# Altium schematic sheet mishen.SchDoc
size A4
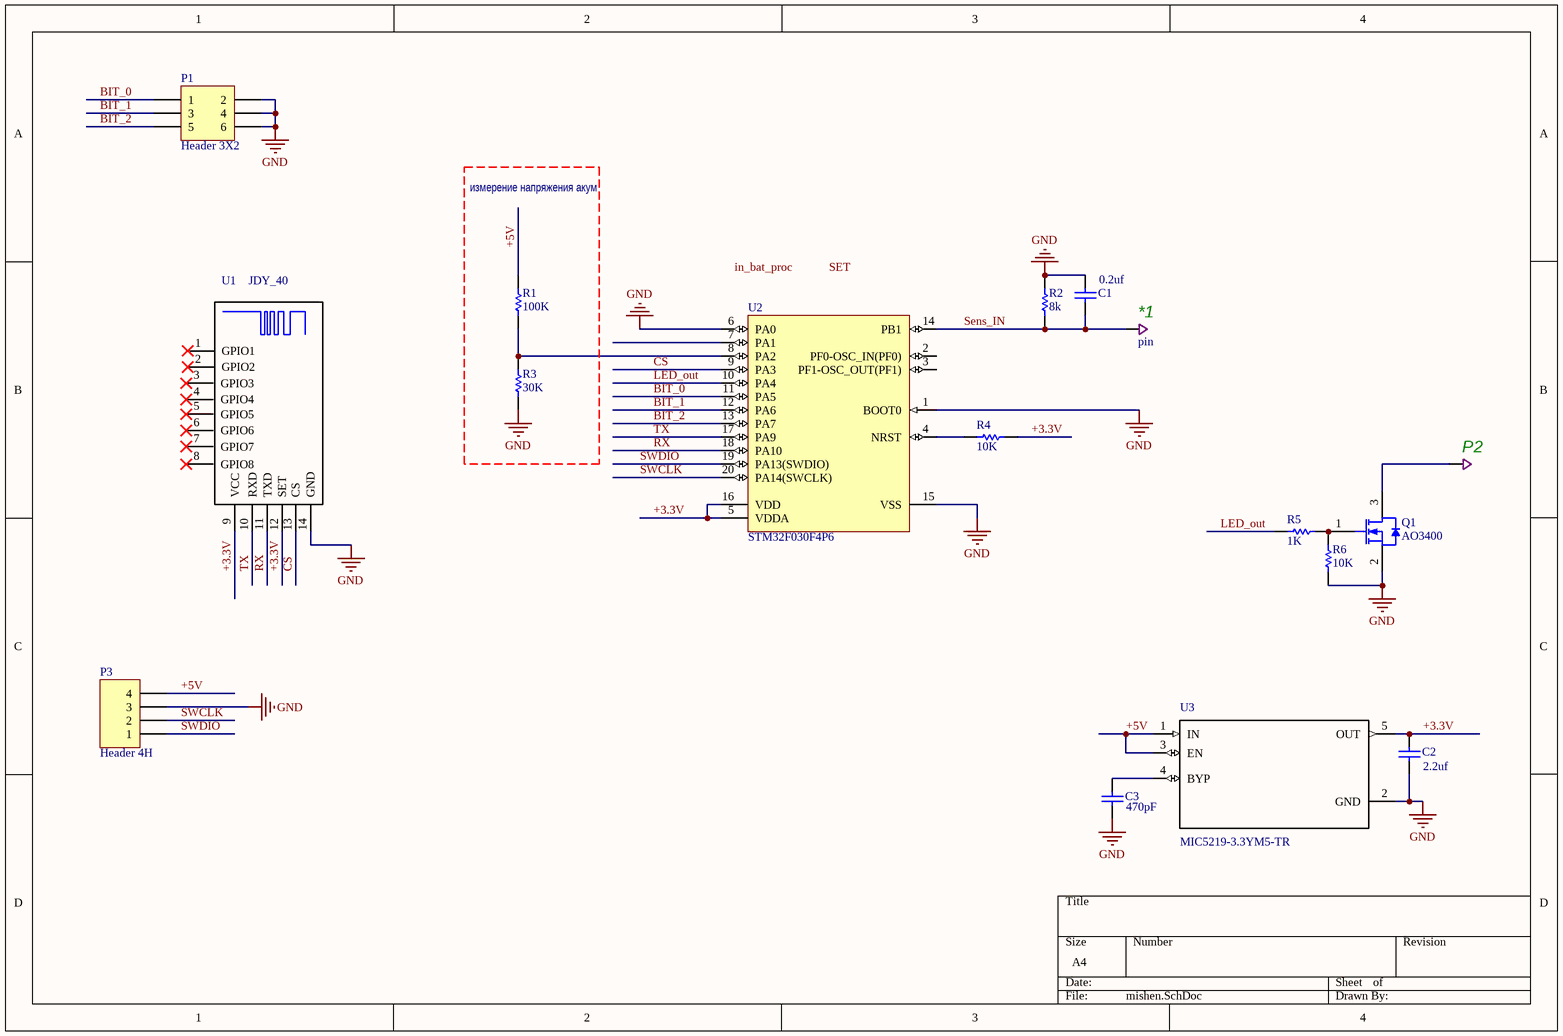
[diagram p0: mishen.SchDoc]

## Parts
*1  pin  [pin]
C1  0.2uf  [CAPC0603(1608)100_L]
C2  2.2uf  [CAPC0603(1608)100_L]
C3  470pF  [CAPC0603(1608)100_L]
P1  Header 3X2  [HDR2X3]
P2  pin  [pin]  (value not drawn)
P3  Header 4H  [HDR1X4H]
Q1  AO3400  [AO-SOT23-3_V]
R1  100K  [RESC2013X70X40ML20T20]
R2  8k  [RESC2013X70X40ML20T20]
R3  30K  [RESC2013X70X40ML20T20]
R4  10K  [RESC2013X70X40ML20T20]
R5  1K  [RESC2013X70X40ML20T20]
R6  10K  [RESC2013X70X40ML20T20]
U1  JDY_40  [JDY_40]
U2  STM32F030F4P6  [STM-TSSOP20_N]
U3  MIC5219-3.3YM5-TR  [mic51]

## Nets
GND: C1.2 C2.1 C3.1 P1.2 P1.4 P1.6 P3.3 Q1.2(S) R2.1 R3.2 R6.2 U1.14(GND) U2.1(BOOT0) U2.6(PA0) U2.15(VSS) U3.2(GND)
+3.3V: C2.2 R4.1 U1.9(VCC) U1.12(SET) U2.5(VDDA) U2.16(VDD) U3.5(OUT)
+5V: P3.4 R1.1 U3.1(IN) U3.3(EN)
BIT_0: P1.1 U2.11(PA5)
BIT_1: P1.3 U2.12(PA6)
BIT_2: P1.5 U2.13(PA7)
CS: U1.13(CS) U2.9(PA3)
LED_out: R5.2 U2.10(PA4)
RX: U1.11(TXD) U2.18(PA10)
Sens_IN: *1.0 C1.1 R2.2 U2.14(PB1)
SWCLK: P3.2 U2.20(PA14(SWCLK))
SWDIO: P3.1 U2.19(PA13(SWDIO))
TX: U1.10(RXD) U2.17(PA9)
NetC3_2: C3.2 U3.4(BYP)
NetP2_0: P2.0 Q1.3(D)
NetQ1_1: Q1.1(G) R5.1 R6.1
NetR1_2: R1.2 R3.1 U2.8(PA2)
NetR4_2: R4.2 U2.4(NRST)

Not connected (* = marked no-connect by the designer): U1 1(GPIO1)* 2(GPIO2)* 3(GPIO3)* 4(GPIO4)* 5(GPIO5)* 6(GPIO6)* 7(GPIO7)* 8(GPIO8)*; U2 2(PF0-OSC_IN(PF0)) 3(PF1-OSC_OUT(PF1)) 7(PA1)

## Notes on the sheet
- измерение напряжения акум
- Labels drawn without touching a wire or pin: in_bat_proc, SET

## Library data of the parts
C1-C3 = CMP-1590-00005-1: 0603 (1608 Metric) Chip Capacitor; Case-Metric: 1608; Case-EIA: 0603; PackageReference: CAPC0603(1608)100
P1 = Header 3X2: Header, 3-Pin, Dual row; LatestRevisionDate: 17-Jul-2002; LatestRevisionNote: Re-released for DXP Platform.; Publisher: Altium Limited
P3 = Header 4H: Header, 4-Pin, Right Angle; LatestRevisionDate: 17-Jul-2002; LatestRevisionNote: Re-released for DXP Platform.; Publisher: Altium Limited
Q1 = CMP-0278-00001-1: N-channel Enhancement Mode Field-Effect Transistor; 5.8A/30V; Manufacturer: Alpha and Omega; Channel Type: N; Drain-Source Voltage Limit: 30 V; Junction Temperature: -55 to 150 degC; Gate-Source Voltage Limit: +/-12 V; PackageDescription: 3-Pin SOT23, 3.016 x 2.8 mm Body, 0.95 mm Pitch; ComponentLink2Description: Datasheet; DatasheetVersion: Rev.8, 12/2011; ComponentLink3URL: http://www.aosmd.com/res/packaging_information/SOT-23.pdf; Storage Temperature: -55 to 150 degC; ComponentLink3Description: Package Specification; PackageReference: SOT23; ComponentLink1Description: Manufacturer URL; Mounting Technology: Surface Mount; ComponentLink1URL: http://www.aosmd.com/; PartNumber: AO3400; ComponentLink2URL: http://www.aosmd.com/res/data_sheets/AO3400.pdf
R1-R6 = CMP-2001-04440-2: RES SMD 150K OHM 1% 1/8W 0805; Manufacturer: Panasonic; Part Number: ERJ-6ENF1503V; Case-EIA: 0805; Datasheet: http://industrial.panasonic.com/cdbs/www-data/pdf/RDA0000/AOA0000C86.pdf
U1 = JDY_40: MF: Advanced Monolithic Systems; Availability: Unavailable; SnapEDA_Link: https://www.snapeda.com/parts/AMS1117-5.0/Advanced%20Monolithic%20Systems/view-part/?ref=snap; Package: None; MP: JDY_40; Price: None; Value: *
U2 = CMP-0304-00039-2: ARM Cortex-M0 32-bit MCU, 16 KB Flash, 4 KB Internal RAM, 15 I/Os, 20-pin TSSOP, -40 to 85 degC, Tube; I/Os (High Current): 15; FLASH Size (Prog) (kB): 16; Internal RAM Size (kB): 4; Supply Voltage(Vcc) min (V): 2.4; Operating Frequency(F) (Processor speed) (MHz): 48; ComponentLink2URL: http://www.st.com/st-web-ui/static/active/en/resource/technical/document/datasheet/DM00088500.pdf; Core: ARM Cortex-M0; ComponentLink2Description: Datasheet; PackageDescription: 20-Pin Thin Shrink Small Outline Package, 6.5 x 4.4 mm Body, 0.65 mm Pitch; Mounting Technology: Surface Mount; ComponentLink1URL: http://www.st.com/web/en/home.html; PackageVersion: Rev. 1, 11/2012; ComponentLink3Description: Package Specification; PartNumber: STM32F030F4P6; ComponentLink3URL: http://www.st.com/st-web-ui/static/active/en/resource/technical/document/datasheet/DM00065136.pdf; DatasheetVersion: Rev. 1; PackageReference: TSSOP20; ComponentLink1Description: Manufacturer URL; Packing: Tube
U3 = MIC5219-3.3YM5-TR: MIC5219 Series 500 mA 3.3 V Fixed Output Surface Mount LDO Regulator - SOT-23-5; MF: Microchip; Package: SOT-23 Microchip; Price: None; MP: MIC5219-3.3YM5-TR; Availability: Unavailable; SnapEDA_Link: https://www.snapeda.com/parts/MIC5219-3.3YM5-TR/Microchip/view-part/?ref=snap; Value: *